# EAGLE design ftdifriend (EAGLE 9.6.2)
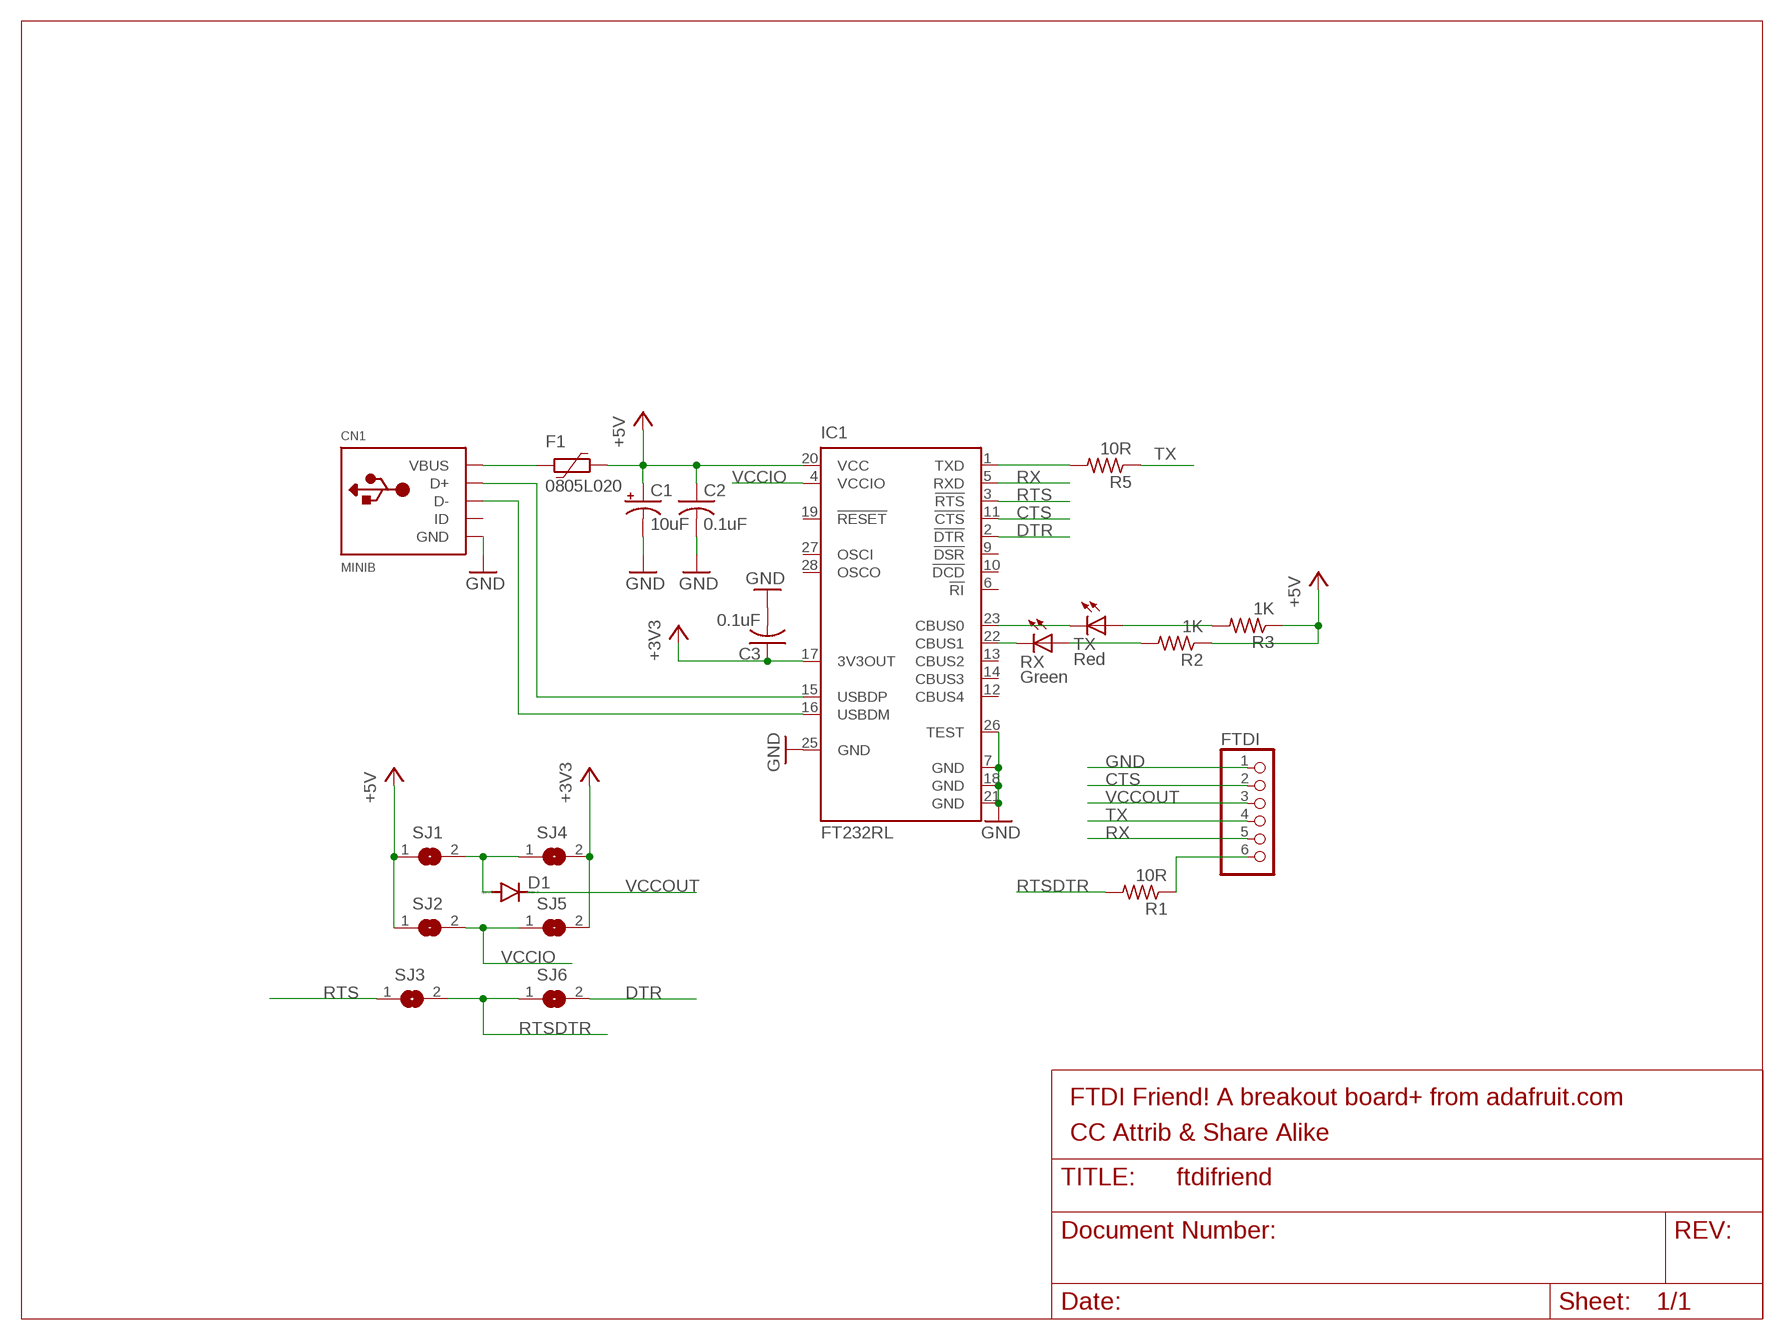
[diagram p0: schematic, sheet 1]

## Parts
C1  10uF  CPOL-USA/3216-18R  [A/3216-18R]
C2  0.1uF  C-USC0805K  [C0805K]
C3  0.1uF  C-USC0805K  [C0805K]
CN1  MINIB  USBMINIB  [USB-MINIB]
D1  CUS10F30  DIODE-SOD323-W  [SOD323-W]
F1  0805L020  [0805L]
FTDI  PINHD-1X6CB  [1X06-CLEANBIG]
IC1  FT232RL  [SSOP28]
R1  10R  R-US_R0805  [R0805]
R2  1K  R-US_R0805  [R0805]
R3  1K  R-US_R0805  [R0805]
R5  10R  R-US_R0805  [R0805]
RX  Green  LEDCHIP-LED0805  [CHIP-LED0805]
SJ1  SJ  [SJ]
SJ2  SJ  [SJ]
SJ3  SJ  [SJ]
SJ4  SJ  [SJ]
SJ5  SJ  [SJ]
SJ6  SJ  [SJ]
TX  Red  LEDCHIP-LED0805  [CHIP-LED0805]

## Nets
+3V3: C3.1 IC1.17(3V3OUT) SJ4.2 SJ5.2
+5V: C1.+ C2.1 F1.1 IC1.20(VCC) R2.1 R3.1 SJ1.1 SJ2.1
CTS: FTDI.2 IC1.11(!CTS)
D+: CN1.D+ IC1.15(USBDP)
D-: CN1.D- IC1.16(USBDM)
DTR: IC1.2(!DTR) SJ6.2
GND: C1.- C2.2 C3.2 CN1.GND FTDI.1 IC1.7(GND) IC1.18(GND) IC1.21(GND) IC1.25(GND) IC1.26(TEST)
N$2: FTDI.6 R1.1
N$5: IC1.1(TXD) R5.2
N$6: IC1.23(CBUS0) TX.C
N$7: IC1.22(CBUS1) RX.C
N$8: R2.2 RX.A
N$9: R3.2 TX.A
N$10: CN1.VBUS F1.2
RTS: IC1.3(!RTS) SJ3.1
RTSDTR: R1.2 SJ3.2 SJ6.1
RX: FTDI.5 IC1.5(RXD)
TX: FTDI.4 R5.1
VCCIO: IC1.4(VCCIO) SJ2.2 SJ5.1
VCCOUT: D1.C FTDI.3
VCCOUT_A: D1.A SJ1.2 SJ4.1
Unconnected: CN1.ID IC1.6(!RI) IC1.9(!DSR) IC1.10(!DCD) IC1.12(CBUS4) IC1.13(CBUS2) IC1.14(CBUS3) IC1.19(!RESET) IC1.27(OSCI) IC1.28(OSCO)

## Notes on the sheet
- FTDI Friend! A breakout board+ from adafruit.com
- CC Attrib & Share Alike

## Library data of the parts
C1 = adafruit:CPOL-US: POLARIZED CAPACITOR, American symbol
C2 C3 = adafruit:C-US: CAPACITOR, American symbol
CN1 = adafruit:USB: USB Connectors USBMINIB - Surface Mount Female Mini-B USB Connector 4UConnector: 06564 By microbuilder.eu Thru-hole RA Female Mini-B USB Connector 4UConnector: 18732 By ladyada.net
D1 = diode:DIODE-: DIODE
F1 = polyfuse-smd_20:?: Polyfuse Resettable PTC Source: http://www.littelfuse.com/products/resettable-ptcs.aspx; MF: Littelfuse; MPN: 0805L020; OC_FARNELL: 1832107; OC_NEWARK: 05M2226
FTDI = adafruit:PINHD-1X6: PIN HEADER
IC1 = ftdichip:FT232R: Source: http://www.ftdichip.com/Documents/DataSheets/DS_FT232R_v104.pdf
R1-R3 R5 = adafruit:R-US_: RESISTOR, American symbol
RX TX = adafruit:LED: LED OSRAM: - CHIPLED LG R971, LG N971, LY N971, LG Q971, LY Q971, LO R971, LY R971 LH N974, LH R974 LS Q976, LO Q976, LY Q976 LO Q996 - Hyper CHIPLED LW Q18S LB Q993, LB Q99A, LB R99A - SideLED LS A670, LO A670, LY A670, LG A670, LP A670 LB A673, LV A673, LT A673, LW A673 LH A674 LY A675 LS A676, LA A676, LO A676, LY A676, LW A676 LS A679, LY A679, LG A679 - Hyper Micro SIDELED® LS Y876, LA Y876, LO Y876, LY Y876 LT Y87S - SmartLED LW L88C, LW L88S LB L89C, LB L89S, LG L890 LS L89K, LO L89K, LY L89K LS L896, LA L896, LO L896, LY L896 - TOPLED LS T670, LO T670, LY T670, LG T670, LP T670 LSG T670, LSP T670, LSY T670, LOP T670, LYG T670 LG T671, LOG T671, LSG T671 LB T673, LV T673, LT T673, LW T673 LH T674 LS T676, LA T676, LO T676, LY T676, LB T676, LH T676, LSB T676, LW T676 LB T67C, LV T67C, LT T67C, LS T67K, LO T67K, LY T67K, LW E67C LS E67B, LA E67B, LO E67B, LY E67B, LB E67C, LV E67C, LT E67C LW T67C LS T679, LY T679, LG T679 LS T770, LO T770, LY T770, LG T770, LP T770 LB T773, LV T773, LT T773, LW T773 LH T774 LS E675, LA E675, LY E675, LS T675 LS T776, LA T776, LO T776, LY T776, LB T776 LHGB T686 LT T68C, LB T68C - Hyper Mini TOPLED® LB M676 - Mini TOPLED Santana® LG M470 LS M47K, LO M47K, LY M47K Source: http://www.osram.convergy.de/
SJ1-SJ6 = jumper:SJ: SMD solder JUMPER

## Board
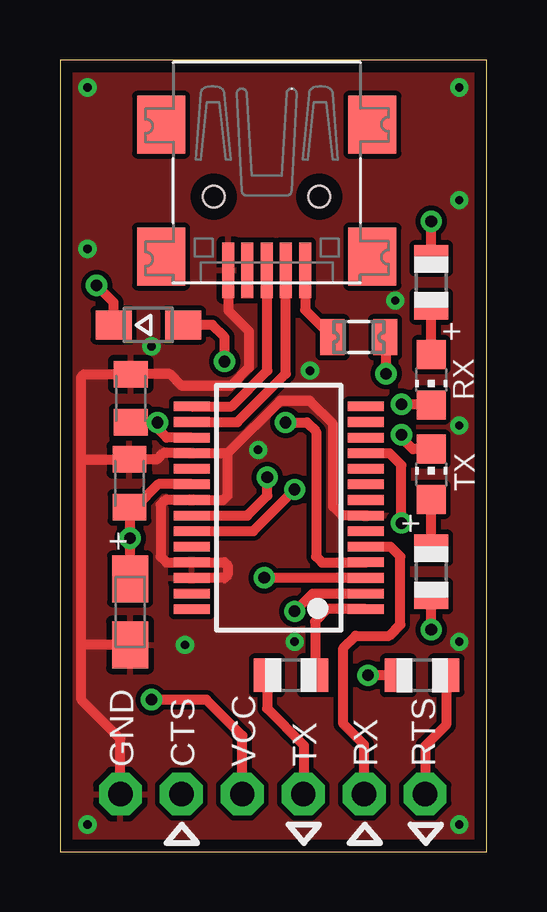
[diagram p1: board, top side]
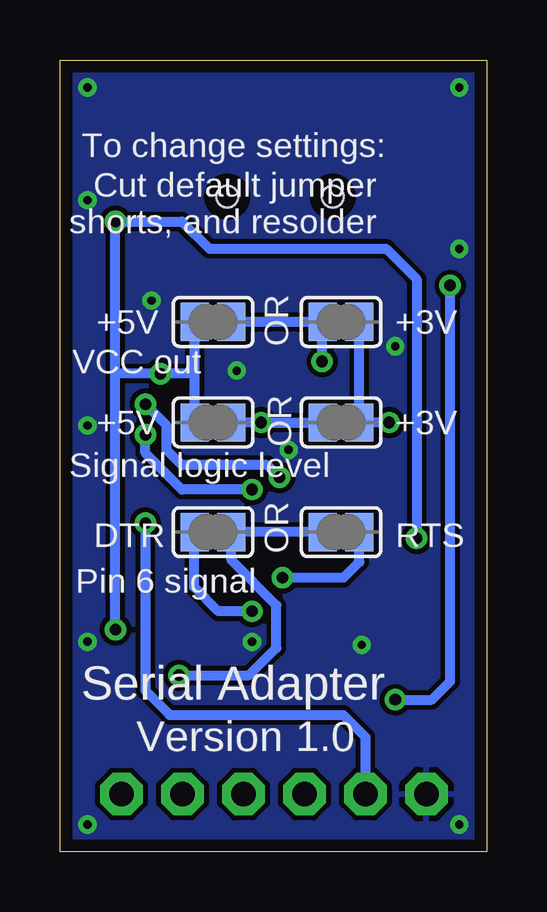
[diagram p2: board, bottom side, seen from below]

Size 17.78 x 33.02 mm. Coordinates in mm from the lower left corner, seen from the top.
Outline: 0,33.02 0,0 17.78,0 17.78,33.02 0,33.02
Copper layers (1*16): Top 0.035mm / dielectric 1.5mm / Bottom 0.035mm
Design rules "default *": minimum track width 10mil, minimum drill 19mil, track to track 8mil, track to pad 8mil, pad to pad 8mil, via to via 8mil, smd to smd 8mil, copper to edge 20mil, drill to drill 8mil, minimum pad ring 10mil, minimum via ring 8mil, stop-mask expansion 4mil, vias tented up to drill 20mil, thermal gap 10mil

### Footprints (pad centres in the part's own frame; a part is rotated, then mirrored left to right if it is on the bottom)
A/3216-18R = smd 1.95 x 1.5: + 1.375,0; - -1.375,0
C0805K = smd 1.1 x 1.4: 1 -1,0; 2 1,0
USB-MINIB = smd 0.5 x 2.308: D+ 0,4.064; D- -0.8,4.064; GND 1.6,4.064; ID 0.8,4.064; VBUS -1.6,4.064 | smd 2 x 2.4: GND1 -4.4,-2; GND2 -4.4,3.5; GND3 4.4,3.5; GND4 4.4,-2 | hole 0.9: -2.2,1; 2.2,1
SOD323-W = smd 1.5 x 1.2: A 1.45,0; C -1.45,0
0805L = smd 1 x 1.5: 1 -1.1,0; 2 1.1,0
1X06-CLEANBIG = drill 1.016 pad 1.778 octagon: 1 -6.35,0; 2 -3.81,0; 3 -1.27,0; 4 1.27,0; 5 3.81,0; 6 6.35,0
SSOP28 = smd 0.4 x 1.5: 1 -4.225,-3.625; 2 -3.575,-3.625; 3 -2.925,-3.625; 4 -2.275,-3.625; 5 -1.625,-3.625; 6 -0.975,-3.625; 7 -0.325,-3.625; 8 0.325,-3.625; 9 0.975,-3.625; 10 1.625,-3.625; 11 2.275,-3.625; 12 2.925,-3.625; 13 3.575,-3.625; 14 4.225,-3.625; 15 4.225,3.625; 16 3.575,3.625; 17 2.925,3.625; 18 2.275,3.625; 19 1.625,3.625; 20 0.975,3.625; 21 0.325,3.625; 22 -0.325,3.625; 23 -0.975,3.625; 24 -1.625,3.625; 25 -2.275,3.625; 26 -2.925,3.625; 27 -3.575,3.625; 28 -4.225,3.625
R0805 = smd 1.1 x 1.4: 1 -1,0; 2 1,0
CHIP-LED0805 = smd 1.2 x 1.2: A 0,-1.05; C 0,1.05
SJ = smd 1.168 x 1.6: 1 -0.762,0; 2 0.762,0

### Placement (x,y rotation side)
C1  2.92,10.01 90 top
C2  2.9,15.37 90 top
C3  2.95,18.92 90 top
CN1  8.61,28.32 180 top
D1  3.68,21.97 0 top
F1  12.45,21.46 180 top
FTDI  8.86,2.41 0 top
IC1  9.12,14.35 90 top
R1  15.09,7.37 180 top
R2  15.47,23.75 270 top
R3  15.47,11.68 90 top
R5  9.63,7.37 0 top
RX  15.47,19.68 180 top
SJ1  11.4,22.1 0 bottom
SJ2  11.4,17.91 0 bottom
SJ3  6.07,13.34 180 bottom
SJ4  6.07,22.1 0 bottom
SJ5  6.07,17.91 0 bottom
SJ6  11.4,13.34 180 bottom
TX  15.47,15.75 0 top

### Tracks (layer width: path | path; a pad name or v marks a point on that pad's centre or on a via)
+3V3  (via drill 0.48)
  Top 0.254: 3.17,17.78 3.19,17.8 | 3.43,17.53 3.17,17.78 | 2.92,18.03 2.95,18.01 | 2.95,18.01 C3.1 | 3.17,17.78 2.95,18.01 | 5.49,17.27 IC1.17 5.49,17.27 | 4.05,17.92 v4.06,17.91
  Top 0.406: C3.1 4.05,17.92 | IC1.17 4.44,17.28 4.06,17.65 v4.06,17.91
  Bottom 0.254: 5.31,18.29 SJ5.2 5.21,17.91
  Bottom 0.406: 5.31,18.29 SJ4.2 | v4.06,17.91 5.21,17.91 6.6,17.91
+5V  (via drill 0.48)
  Top 0.254: 2.92,14.48 2.9,14.45 C2.1 | IC1.20 | 3.13,14.37 C2.1 | 2.92,14.34 C2.1 | 13.59,21.42 F1.1
  Top 0.406: IC1.20 4.1,15.33 3.13,14.37 | C1.+ v2.92,13.08 2.92,14.34 | v13.59,19.94 13.59,21.42 | v15.47,9.27 R3.1 | R2.1 v15.47,26.29
  Bottom 0.254: SJ1.1 12.19,22.1 12.17,22.07
  Bottom 0.406: SJ2.1 12.17,19.94 | 12.17,19.94 12.17,22.07 | 12.17,19.94 v13.59,19.94 15.47,19.94 | v15.47,9.27 15.47,19.94 | 15.47,19.94 v15.47,26.29 12.7,26.29 11.56,25.15 4.19,25.15 2.92,23.88 v2.92,13.08 | 10.29,22.1 12.19,22.1
CTS  (via drill 0.48)
  Top 0.254: 12.17,16.64 12.18,16.63 IC1.11
  Top 0.406: IC1.11 13.73,16.63 14.22,16.13 v14.22,13.72
  Bottom 0.406: v14.22,13.72 14.22,6.73 13.21,5.71 5.97,5.71 5.05,4.8 FTDI.2
D+
  Top 0.254: 8.64,24.23 CN1.D+
  Top 0.406: IC1.15 7.15,18.58 8.64,20.07 8.64,24.23
D-
  Top 0.254: IC1.16 5.5,17.92
  Top 0.406: CN1.D- 9.41,19.94 7.39,17.92 5.5,17.92
DTR  (via drill 0.48)
  Top 0.406: v9.78,10.03 10.52,10.78 IC1.2
  Bottom 0.254: 12.19,13.31 SJ6.2
  Bottom 0.406: v9.78,10.03 11.18,10.03 12.19,11.05 12.19,13.31
GND  (via drill 0.35)
  Top 0.254: 0.89,8.63 0.89,8.64 | 0.89,16.26 1,16.37 | 5.48,12.06 IC1.25
  Top 0.406: 6.99,16.63 IC1.18 4.31,16.63 4.05,16.37 C2.2 1,16.37 | C1.- 0.89,8.63 | CN1.GND 7.01,22.58 7.87,21.72 7.87,20.19 7.11,19.43 5.08,19.43 4.59,19.92 C3.2 1,19.92 0.89,19.81 0.89,16.26 0.89,8.64 0.89,6.35 2.52,4.72 FTDI.1 | 5.48,12.06 4.45,12.06 4.19,12.32 4.19,14.48 4.39,14.68 IC1.21 6.8,14.68 6.99,14.86 6.99,16.63 | IC1.7 11.76,14.03 11.38,14.4 11.38,17.84 10.41,18.81 9.17,18.81 6.99,16.63 | IC1.25 6.85,12.08 6.99,11.94 6.99,11.56 6.85,11.43 IC1.26
  other vias: 8.26,16.76 1.14,31.88 16.64,31.88 16.64,1.14 1.14,1.14 5.21,8.64 13.97,22.99 16.64,8.76 16.64,17.78 16.64,27.18 1.14,25.15 10.41,20.07 3.81,21.08 9.78,8.76
  pour Top: 18.26,33.15 -0.28,33.15 -0.53,-0.13 18.01,0
  pour Bottom: 18.26,33.15 -0.25,33.15 -0.51,-0.13 18.01,0
N$1
  Bottom 0.406: 12.19,13.34 10.67,13.34
N$2
  Top 0.406: R1.1 16.09,5.29 15.21,4.42 FTDI.6
N$5
  Top 0.254: R5.2 10.54,7.37 10.68,7.22 10.88,7.22
  Top 0.406: IC1.1 11.14,10.13 10.63,9.61 R5.2
N$6  (via drill 0.48)
  Top 0.254: 5.05,13.34 5.01,13.38 IC1.23 | 15.62,16.64 15.62,16.57 | 15.62,16.64 15.62,16.77 | 15.62,16.64 TX.C | TX.C | 15.08,17.18 TX.C | v9.79,15.11 v9.78,15.11 | 15.44,16.76 TX.C
  Top 0.406: v9.79,15.11 8.05,13.38 IC1.23 | TX.C 14.7,16.8 14.22,17.27 v14.22,17.4
  Bottom 0.406: v9.78,15.11 12.7,15.11 14.22,16.64 v14.22,17.4
N$7  (via drill 0.48)
  Top 0.254: 15.44,18.67 RX.C
  Top 0.406: IC1.22 7.8,14.03 8.64,14.86 v8.64,15.62 | v14.22,18.67 15.44,18.67
  Bottom 0.406: v8.64,15.62 9.14,16.13 12.7,16.13 13.34,16.76 13.34,17.78 v14.22,18.67
N$8
  Top 0.254: RX.A 15.49,20.76
  Top 0.406: RX.A R2.2
N$9
  Top 0.406: R3.2 TX.A
N$10
  Top 0.406: CN1.VBUS 10.21,22.6 F1.2
RTS  (via drill 0.48)
  Top 0.254: v8.51,11.43
  Top 0.406: IC1.3 v8.51,11.43
  Bottom 0.254: 5.56,13.59 SJ3.1 5.33,13.34 5.46,13.21 5.59,13.21
  Bottom 0.406: SJ3.1 5.31,12.09 5.97,11.43 v8.51,11.43
RTSDTR  (via drill 0.48)
  Top 0.406: R1.2 v12.83,7.37
  Bottom 0.254: 10.54,13.46 10.54,13.44 SJ6.1
  Bottom 0.406: SJ3.2 SJ6.1 10.64,12.17 8.76,10.29 8.76,8.51 9.91,7.37 v12.83,7.37
RX
  Top 0.406: FTDI.5 12.68,4.47 11.81,5.33 11.81,8.51 12.32,9.02 13.72,9.02 14.18,9.48 14.18,12.32 13.78,12.73 IC1.5
TX
  Top 0.254: 10.16,2.44 FTDI.4
  Top 0.406: R5.1 8.63,5.98 10.16,4.45 10.16,2.44
VCCIO  (via drill 0.48)
  Top 0.254: 12.73,12.06 IC1.4
  Top 0.406: v9.4,17.91 10.29,17.91 10.67,17.53 10.67,12.32 10.92,12.06 12.73,12.06
  Bottom 0.406: SJ5.1 v9.4,17.91 SJ2.2
VCCOUT  (via drill 0.48)
  Top 0.406: D1.C 2.23,22.91 v1.52,23.62 | FTDI.3 7.59,4.85 6.1,6.35 v3.81,6.35
  Bottom 0.406: v3.81,6.35 2.29,6.35 1.52,7.11 v1.52,23.62
VCCOUT_A  (via drill 0.48)
  Top 0.406: v6.86,20.45 6.86,21.46 6.35,21.97 D1.A
  Bottom 0.254: 7.09,22.35 SJ4.1 6.83,21.97 6.86,21.97
  Bottom 0.406: SJ4.1 SJ1.2 | v6.86,20.45 6.86,21.97

### Text on the board
tPlace: GND | CTS | VCC | TX | RX | RTS
bPlace: To change settings: | Cut default jumper | shorts, and resolder | OR | +3V | +5V | VCC out | OR | +3V | +5V | Signal logic level | OR | RTS | DTR | Pin 6 signal | Serial Adapter | Version 1.0